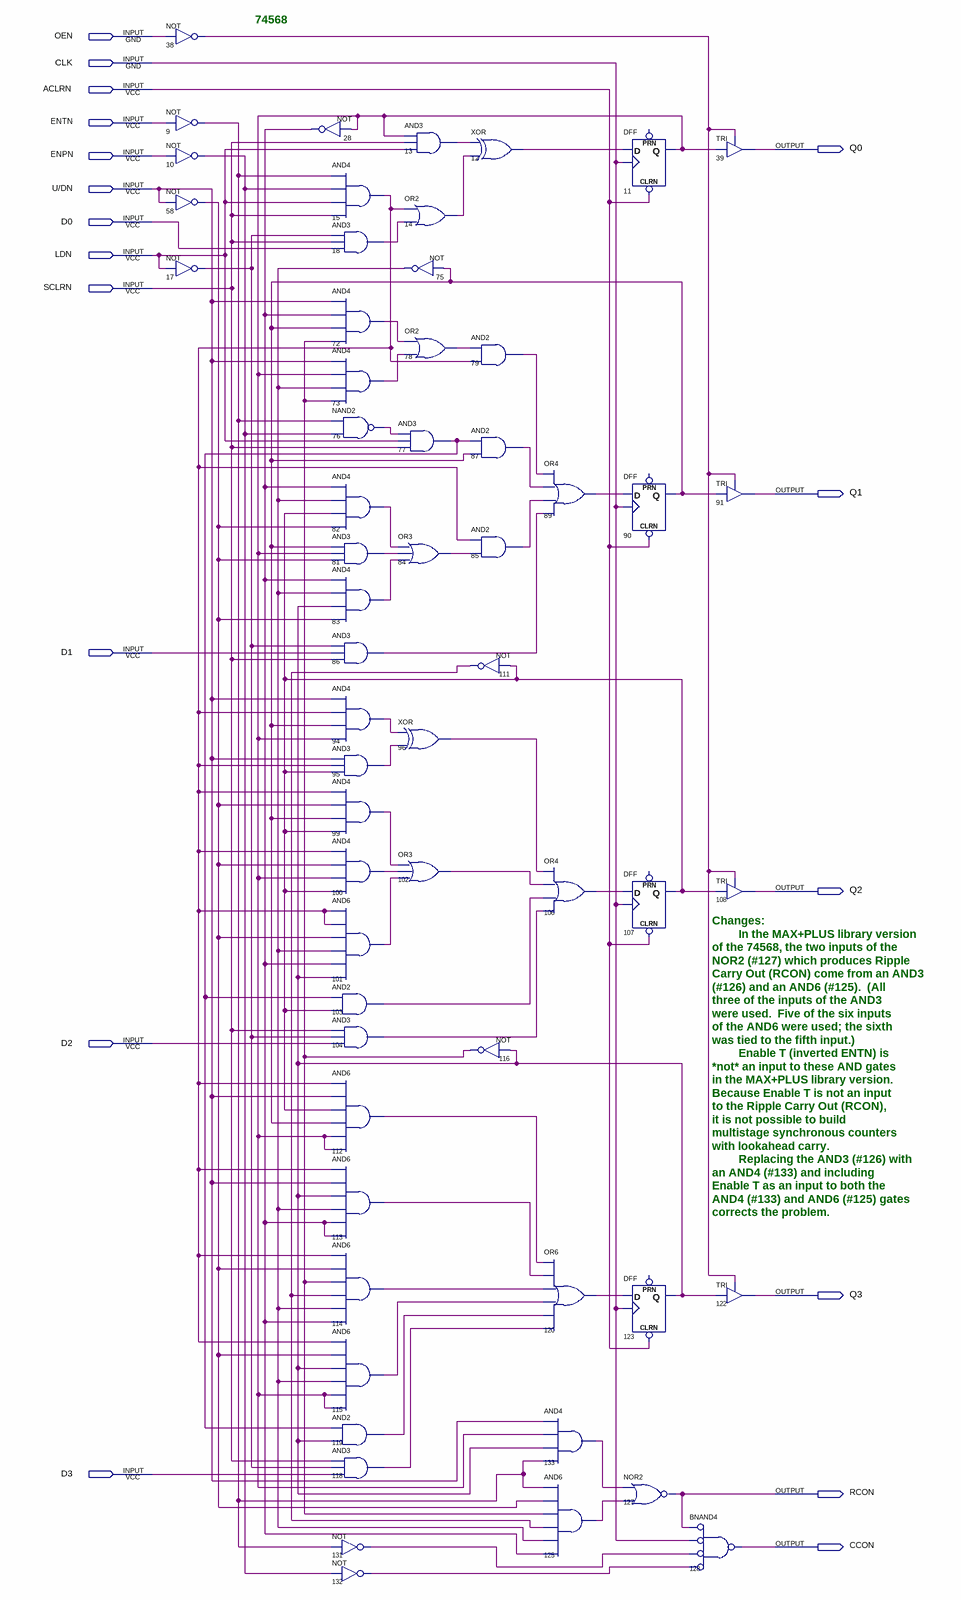
[diagram p0: schematic sheet]
// Quartus schematic 74568.bdf as structural Verilog: 59 symbols, 18 pins
module \74568  (
  input  OEN,
  input  CLK,
  input  ACLRN,
  input  ENTN,
  input  ENPN,
  input  \U/DN ,
  input  D0,
  input  LDN,
  input  SCLRN,
  input  D1,
  input  D2,
  input  D3,
  output Q0,
  output Q1,
  output Q2,
  output Q3,
  output RCON,
  output CCON
);

  wire n9_out, n10_out, n11_q, n12_out, n13_out, n14_out, n15_out, n17_out, n18_out, n28_out, n38_out,
       n58_out, n72_out, n73_out, n75_out, n76_out, n77_out, n78_out, n79_out, n81_out, n82_out, n83_out,
       n84_out, n85_out, n86_out, n87_out, n89_out, n90_q, n94_out, n95_out, n96_out, n99_out, n100_out,
       n101_out, n102_out, n103_out, n104_out, n106_out, n107_q, n111_out, n112_out, n113_out, n114_out,
       n115_out, n116_out, n118_out, n119_out, n120_out, n123_q, n125_out, n131_out, n132_out, n133_out;

  not u_38 (n38_out, OEN);
  not u_9 (n9_out, ENTN);
  not u_10 (n10_out, ENPN);
  not u_58 (n58_out, \U/DN );
  not u_17 (n17_out, LDN);
  not u_28 (n28_out, n11_q);
  and u_15 (n15_out, n9_out, n10_out, LDN, SCLRN);
  and u_18 (n18_out, n17_out, SCLRN, D0);
  and u_72 (n72_out, \U/DN , n28_out, n90_q, n116_out);
  and u_73 (n73_out, \U/DN , n11_q, n75_out, n116_out);
  nand u_76 (n76_out, n9_out, n10_out);
  and u_82 (n82_out, n28_out, n75_out, n107_q, n58_out);
  and u_81 (n81_out, n90_q, n11_q, n58_out);
  and u_83 (n83_out, n28_out, n75_out, n123_q, n58_out);
  and u_86 (n86_out, n17_out, D1, SCLRN);
  and u_94 (n94_out, \U/DN , n15_out, n90_q, n11_q);
  and u_95 (n95_out, \U/DN , n15_out, n107_q);
  and u_99 (n99_out, n15_out, n58_out, n90_q, n107_q);
  and u_100 (n100_out, n15_out, n58_out, n11_q, n107_q);
  and u_101 (n101_out, n15_out, n15_out, n58_out, n75_out, n28_out, n123_q);
  and u_103 (n103_out, n77_out, n107_q);
  and u_104 (n104_out, SCLRN, n17_out, D2);
  and u_112 (n112_out, n15_out, \U/DN , n107_q, n90_q, n11_q, n11_q);
  and u_113 (n113_out, n15_out, \U/DN , n123_q, n75_out, n28_out, n28_out);
  and u_114 (n114_out, n15_out, n58_out, n116_out, n111_out, n75_out, n28_out);
  and u_115 (n115_out, n15_out, n58_out, n123_q, n75_out, n11_q, n11_q);
  and u_119 (n119_out, n77_out, n123_q);
  and u_118 (n118_out, SCLRN, n17_out, D3);
  not u_131 (n131_out, n9_out);
  not u_132 (n132_out, n10_out);
  and u_13 (n13_out, n11_q, SCLRN, LDN);
  or u_14 (n14_out, n15_out, n18_out);
  not u_75 (n75_out, n90_q);
  or u_78 (n78_out, n72_out, n73_out);
  and u_77 (n77_out, n76_out, LDN, SCLRN);
  or u_84 (n84_out, n82_out, n81_out, n83_out);
  xor u_96 (n96_out, n94_out, n95_out);
  or u_102 (n102_out, n99_out, n100_out, n101_out);
  xor u_12 (n12_out, n13_out, n14_out);
  and u_79 (n79_out, n78_out, n15_out);
  and u_87 (n87_out, n77_out, n90_q);
  and u_85 (n85_out, n15_out, n84_out);
  not u_111 (n111_out, n107_q);
  not u_116 (n116_out, n123_q);
  or u_89 (n89_out, n79_out, n87_out, n85_out, n86_out);
  or u_106 (n106_out, n96_out, n102_out, n103_out, n104_out);
  or u_120 (n120_out, n112_out, n113_out, n114_out, n115_out, n119_out, n118_out);
  and u_133 (n133_out, \U/DN , n11_q, n123_q, n9_out);
  and u_125 (n125_out, n9_out, n58_out, n116_out, n111_out, n75_out, n28_out);
  DFF u_11 (.CLRN(ACLRN), .CLK(CLK), .D(n12_out), .Q(n11_q));  // open: PRN
  DFF u_90 (.CLRN(ACLRN), .CLK(CLK), .D(n89_out), .Q(n90_q));  // open: PRN
  DFF u_107 (.CLRN(ACLRN), .CLK(CLK), .D(n106_out), .Q(n107_q));  // open: PRN
  DFF u_123 (.CLRN(ACLRN), .CLK(CLK), .D(n120_out), .Q(n123_q));  // open: PRN
  nor u_127 (RCON, n133_out, n125_out);
  TRI u_39 (.IN(n11_q), .OE(n38_out), .OUT(Q0));
  TRI u_91 (.IN(n90_q), .OE(n38_out), .OUT(Q1));
  TRI u_108 (.IN(n107_q), .OE(n38_out), .OUT(Q2));
  TRI u_122 (.IN(n123_q), .OE(n38_out), .OUT(Q3));
  nand u_128 (CCON, ~RCON, ~CLK, ~n131_out, ~n132_out);  // BNAND4

  // Notes on the sheet:
  //   74568
  //   Changes:
  //   In the MAX+PLUS library version
  //   of the 74568, the two inputs of the
  //   NOR2 (#127) which produces Ripple
  //   Carry Out (RCON) come from an AND3
  //   (#126) and an AND6 (#125).  (All
  //   three of the inputs of the AND3
  //   were used.  Five of the six inputs
  //   of the AND6 were used; the sixth
  //   was tied to the fifth input.)
  //   Enable T (inverted ENTN) is
  //   *not* an input to these AND gates
  //   in the MAX+PLUS library version.
  //   Because Enable T is not an input
  //   to the Ripple Carry Out (RCON),
  //   it is not possible to build
  //   multistage synchronous counters
  //   with lookahead carry.
  //   Replacing the AND3 (#126) with
  //   an AND4 (#133) and including
  //   Enable T as an input to both the
  //   AND4 (#133) and AND6 (#125) gates
  //   corrects the problem.
endmodule
